# Altium schematic sheet rad_detector_v500_HV_PSU.SchDoc
size A4; SheetNumber: 2; SheetTotal: 7
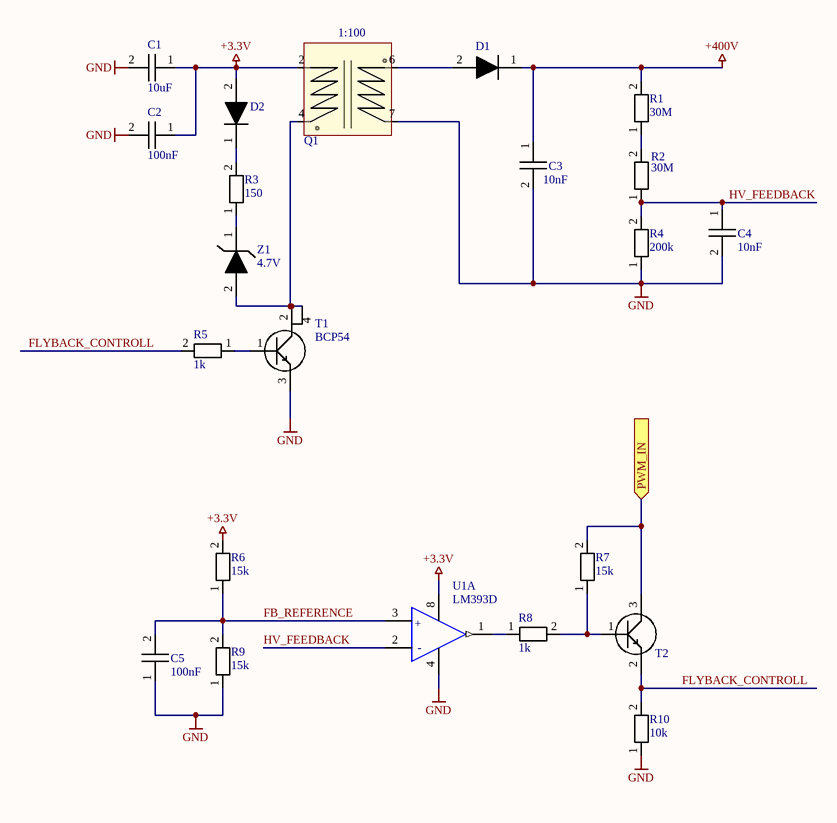
[diagram p0: rad_detector_v500_HV_PSU.SchDoc]

## Parts
C1  10uF  [1210_C]
C2  100nF  [0805_C]
C3  10nF  [CAPACITOR_300MIL]
C4  10nF  [0805_C]
C5  100nF  [0805_C]
D1  DIODE  [DIODE_400MIL]  (value not drawn)
D2  DIODE  [SMD_DIODE_SOD80]  (value not drawn)
Q1  DARFON_CCFL_TRANSFORMER  [DARFON_CCFL_TRANSFORMER]  (value not drawn)
R1  30M  [0805]
R2  30M  [0805]
R3  150  [0805]
R4  200k  [0805]
R5  1k  [0805]
R6  15k  [0805]
R7  15k  [0805]
R8  1k  [0805]
R9  15k  [0805]
R10  10k  [0805]
T1  BCP54  [SOT233-1]
T2  BC848*  [SOT23]  (value not drawn)
U1  LM393D  [SO-8]  (part A of 2)
Z1  4.7V  [SMD_DIODE_SOD80]

## Ports
PWM_IN (in, see rad_detector_v500_MAIN[4B])

## Nets
+3.3V: C1.1 C2.1 D2.2 Q1.2 R6.2 U1.8(Vcc+)
+400V: C3.1 D1.1 R1.2
GND: C1.2 C2.2 C3.2 C4.2 C5.1 Q1.7 R4.1 R9.1 R10.1 T1.3 U1.4(Vcc-)
FB_REFERENCE: C5.2 R6.1 R9.2 U1.3(In1+)
FLYBACK_CONTROLL: R5.2 R10.2 T2.2
HV_FEEDBACK: C4.1 R2.1 R4.2 U1.2(In1-)
PWM_IN: R7.2 T2.3 ; port PWM_IN
NetD1_2: D1.2 Q1.6
NetD2_1: D2.1 R3.2
NetQ1_4: Q1.4 T1.2 T1.4 Z1.2
NetR1_1: R1.1 R2.2
NetR3_1: R3.1 Z1.1
NetR5_1: R5.1 T1.1
NetR7_1: R7.1 R8.2 T2.1
NetR8_1: R8.1 U1.1(Out1)

## Notes on the sheet
- (in symbol DARFON_CCFL_TRANSFORMER) 1:100
- (in symbol LM393D, part A) +; -

## Library data of the parts
C1-C5 = CAPACITOR
R1-R9 = RESISTOR: Parameter 1: 10k
R10 = RESISTOR: Parameter 1: 10k
T2 = TRANSISTOR_NPN
U1 = LM393D: IC VOLT COMPARATOR DUAL LP 8SOIC; Manufacturer: STMicroelectronics; Response Time: 1.3us; Min Supply Voltage: 2V; Input Offset Voltage: 1mV; Input Bias Current: 0.02uA; Max Dual Supply Voltage: 18V; Output Current Per Channel: 18mA; Max Junction Temp: +150°C; Standoff Height: 0.1mm; Number Of Channels: 2; Nominal Supply Current: 0.45-0.6mA; Voltage Gain: 200V/mV; Max Supply Voltage: 36V; Min Dual Supply Voltage: 1V; Ambient Temperature Range Low: 0°C; ComponentLink2Description: Datasheet; Lead Free: Yes; Device Class L3: Comparators; Device Class L2: Linear ICs; Manufacturer Part Number: LM393D; Digikey Description: IC VOLT COMPARATOR DUAL LP 8SOIC; Category: IC; Octopart: https://octopart.com/lm393d-stmicroelectronics-25832; Package: SO8; RoHS: TRUE; Footprint Url: https://www.st.com/resource/en/datasheet/stm8l001j3.pdf; Temperature Range Low: 0°C; Temperature Range High: +70°C; Mouser Description: Analog Comparators Lo-Pwr Dual Voltage; ComponentLink2URL: https://www.st.com/resource/en/datasheet/lm393.pdf; Automotive: No; Temperature: 0°C to +70°C; Height: 1.75mm; Device Class L1: Integrated Circuits (ICs); Ambient Temperature Range High: +70°C
Z1 = DIODE_ZENER